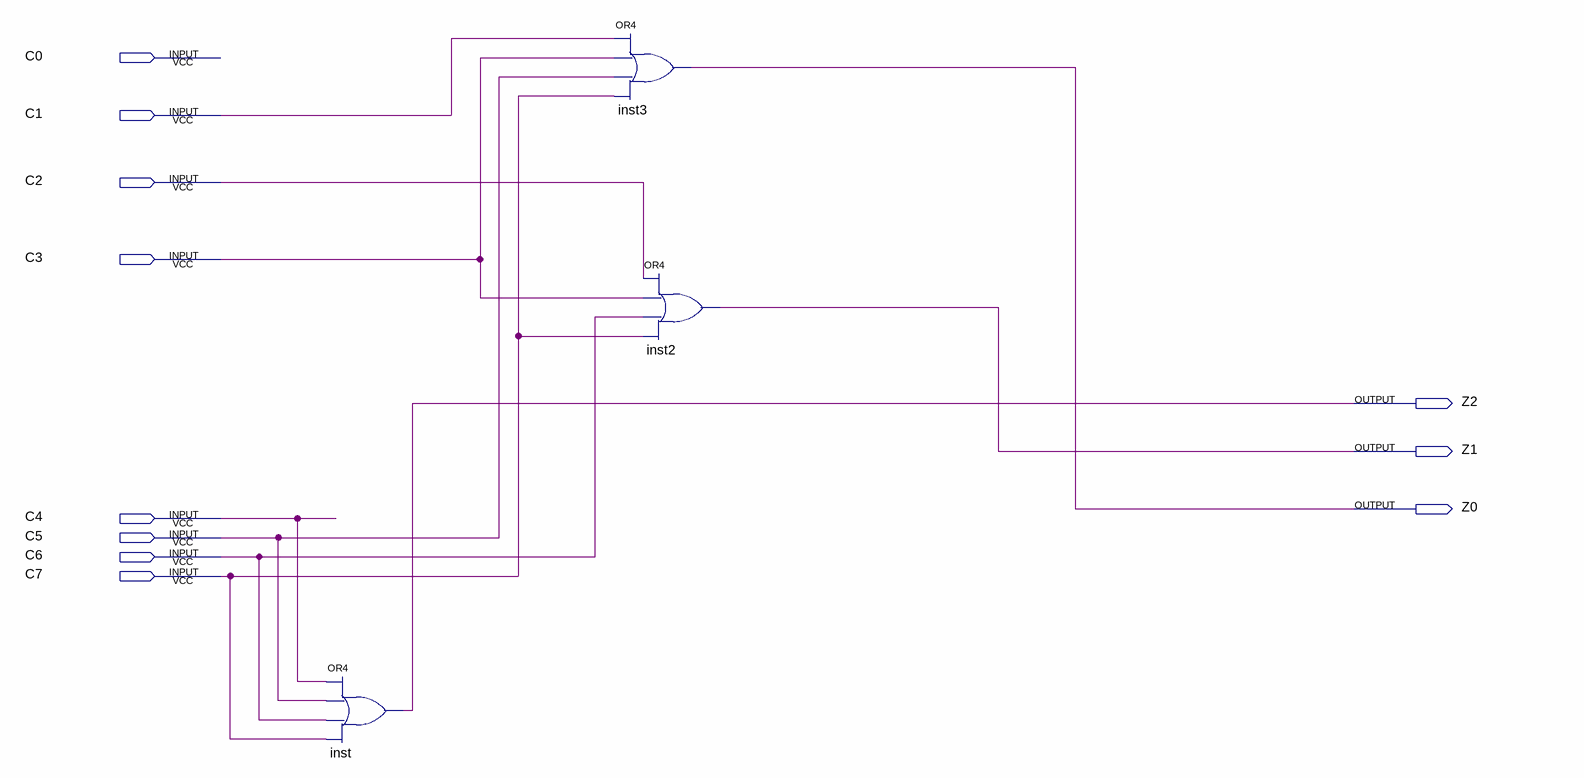
[diagram p0: schematic sheet]
// Quartus schematic cd8.bdf as structural Verilog: 3 symbols, 11 pins
module cd8 (
  input  C0,
  input  C1,
  input  C2,
  input  C3,
  input  C4,
  input  C5,
  input  C6,
  input  C7,
  output Z2,
  output Z1,
  output Z0
);

  or inst (Z2, C4, C5, C6, C7);
  or inst3 (Z0, C1, C3, C5, C7);
  or inst2 (Z1, C2, C3, C6, C7);
endmodule
